# Altium schematic sheet Mux.SchDoc
size A4; SheetNumber: 3; SheetTotal: 6
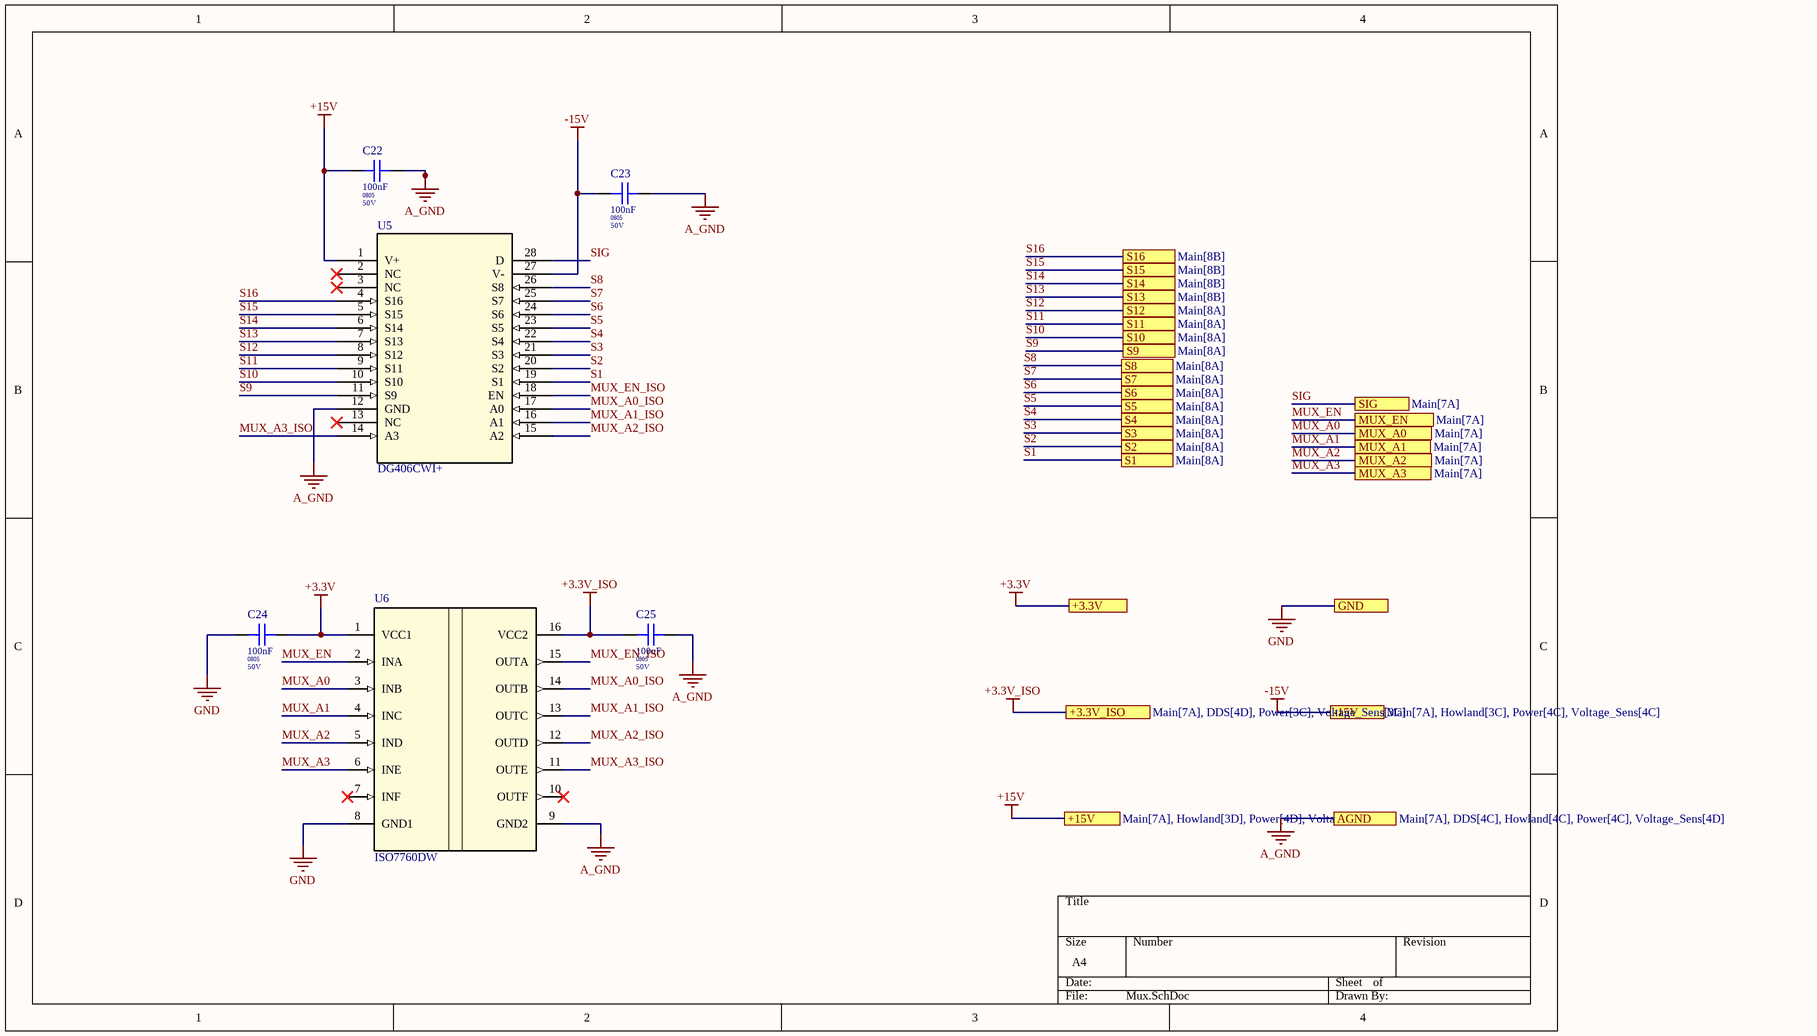
[diagram p0: Mux.SchDoc]

## Parts
C22  Package / Case: 0805  Voltage: 50V  [CAPC 0805]  (hidden comment: 100nF)
C23  Package / Case: 0805  Voltage: 50V  [CAPC 0805]  (hidden comment: 100nF)
C24  Package / Case: 0805  Voltage: 50V  [CAPC 0805]  (hidden comment: 100nF)
C25  Package / Case: 0805  Voltage: 50V  [CAPC 0805]  (hidden comment: 100nF)
U5  DG406CWI+  [21-0042_W28+6_MXM]
U6  ISO7760DW  [DW0016B_M]

## Ports
+3.3V, +3.3V_ISO (see Main[7A], DDS[4D], Power[3C], Voltage_Sens[3C]), +15V (see Main[7A], Howland[3D], Power[4D], Voltage_Sens[3D]), -15V (see Main[7A], Howland[3C], Power[4C], Voltage_Sens[4C]), AGND (see Main[7A], DDS[4C], Howland[4C], Power[4C], Voltage_Sens[4D]), GND, MUX_A0 (see Main[7A]), MUX_A1 (see Main[7A]), MUX_A2 (see Main[7A]), MUX_A3 (see Main[7A]), MUX_EN (see Main[7A]), S1 (see Main[8A]), S2 (see Main[8A]), S3 (see Main[8A]), S4 (see Main[8A]), S5 (see Main[8A]), S6 (see Main[8A]), S7 (see Main[8A]), S8 (see Main[8A]), S9 (see Main[8A]), S10 (see Main[8A]), S11 (see Main[8A]), S12 (see Main[8A]), S13 (see Main[8B]), S14 (see Main[8B]), S15 (see Main[8B]), S16 (see Main[8B]), SIG (see Main[7A])

## Nets
+3.3V: C24.1 U6.1(VCC1) ; port +3.3V
+3.3V_ISO: C25.2 U6.16(VCC2) ; port +3.3V_ISO
+15V: C22.2 U5.1(V+) ; port +15V
-15V: C23.2 U5.27(V-) ; port -15V
A_GND: C22.1 C23.1 C25.1 U5.12(GND) U6.9(GND2) ; port AGND
GND: C24.2 U6.8(GND1) ; port GND
MUX_A0: U6.3(INB) ; port MUX_A0
MUX_A0_ISO: U5.17(A0) U6.14(OUTB)
MUX_A1: U6.4(INC) ; port MUX_A1
MUX_A1_ISO: U5.16(A1) U6.13(OUTC)
MUX_A2: U6.5(IND) ; port MUX_A2
MUX_A2_ISO: U5.15(A2) U6.12(OUTD)
MUX_A3: U6.6(INE) ; port MUX_A3
MUX_A3_ISO: U5.14(A3) U6.11(OUTE)
MUX_EN: U6.2(INA) ; port MUX_EN
MUX_EN_ISO: U5.18(EN) U6.15(OUTA)
S1: U5.19(S1) ; port S1
S2: U5.20(S2) ; port S2
S3: U5.21(S3) ; port S3
S4: U5.22(S4) ; port S4
S5: U5.23(S5) ; port S5
S6: U5.24(S6) ; port S6
S7: U5.25(S7) ; port S7
S8: U5.26(S8) ; port S8
S9: U5.11(S9) ; port S9
S10: U5.10(S10) ; port S10
S11: U5.9(S11) ; port S11
S12: U5.8(S12) ; port S12
S13: U5.7(S13) ; port S13
S14: U5.6(S14) ; port S14
S15: U5.5(S15) ; port S15
S16: U5.4(S16) ; port S16
SIG: U5.28(D) ; port SIG

Not connected (* = marked no-connect by the designer): U5 2(NC)* 3(NC)* 13(NC)*; U6 7(INF)* 10(OUTF)*

## Library data of the parts
C22-C25 = CAPC0572: Capacitor Ceramic 100nF 50V 0805; Tolerance: %10; Value Rating: nF; Favorites: Favorite; Value: 100nF; Part Number: CAPC0572; Category: Capacitor Ceramic; Values: 100nF 50V
U5 = DG406CWI+: Improved, 16-Channel/Dual 8-Channel, CMOS Analog Multiplexers; Manufacturer_Name: Analog Devices Inc; Copyright: Copyright (C) 2026 Ultra Librarian. All rights reserved.; Manufacturer_Part_Number: DG406CWI+; RefDes: RefDes; Type: Type
U6 = ISO7760DW: Robust EMC, six-channel, 6/0, reinforced digital isolator 16-SOIC -55 to 125; Manufacturer_Name: Texas Instruments; TYPE: TYPE; RefDes: RefDes; Copyright: Copyright (C) 2025 Ultra Librarian. All rights reserved.; Manufacturer_Part_Number: ISO7760DW